# Altium schematic sheet _Mainboard.SchDoc
size A4
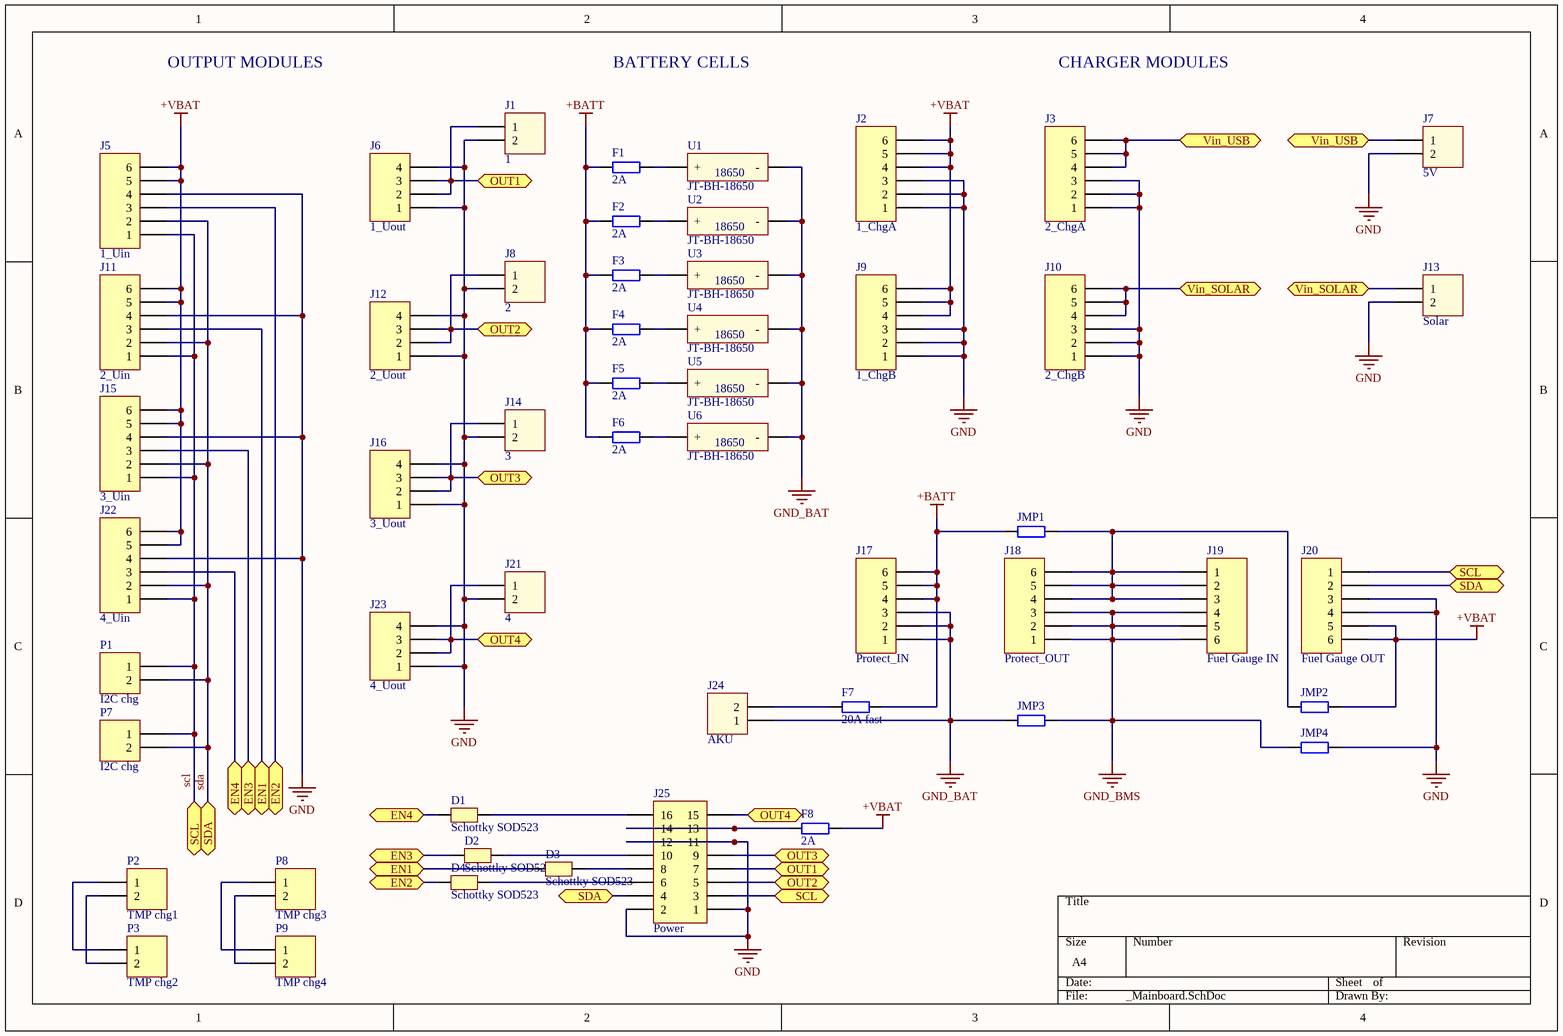
[diagram p0: _Mainboard.SchDoc]

## Parts
D1  Schottky SOD523  [SOD523]
D2  Schottky SOD523  [SOD523]
D3  Schottky SOD523  [SOD523]
D4  Schottky SOD523  [SOD523]
F1  Valve: 2A  [1206 RES]  (hidden comment: SMD fuse)
F2  Valve: 2A  [1206 RES]  (hidden comment: SMD fuse)
F3  Valve: 2A  [1206 RES]  (hidden comment: SMD fuse)
F4  Valve: 2A  [1206 RES]  (hidden comment: SMD fuse)
F5  Valve: 2A  [1206 RES]  (hidden comment: SMD fuse)
F6  Valve: 2A  [1206 RES]  (hidden comment: SMD fuse)
F7  Valve: 20A fast  [1206 RES]  (hidden comment: SMD fuse)
F8  Valve: 2A  [1206 RES]  (hidden comment: SMD Fuse)
J1  1  [691213510002]
J2  1_ChgA  [HDR1X6]
J3  2_ChgA  [HDR1X6]
J5  1_Uin  [HDR1X6]
J6  1_Uout  [HDR1X4]
J7  5V  [691213510002]
J8  2  [691213510002]
J9  1_ChgB  [HDR1X6]
J10  2_ChgB  [HDR1X6]
J11  2_Uin  [HDR1X6]
J12  2_Uout  [HDR1X4]
J13  Solar  [691213510002]
J14  3  [691213510002]
J15  3_Uin  [HDR1X6]
J16  3_Uout  [HDR1X4]
J17  Protect_IN  [HDR1X6]
J18  Protect_OUT  [HDR1X6]
J19  Fuel Gauge IN  [HDR1X6]
J20  Fuel Gauge OUT  [HDR1X6]
J21  4  [691213510002]
J22  4_Uin  [HDR1X6]
J23  4_Uout  [HDR1X4]
J24  AKU  [691213510002]
J25  Power  [61201621621]
JMP1  Resistor generic  [0603 RES]  (value not drawn)
JMP2  Resistor generic  [0603 RES]  (value not drawn)
JMP3  Resistor generic  [0603 RES]  (value not drawn)
JMP4  Resistor generic  [0603 RES]  (value not drawn)
P1  I2C chg  [HDR1X2]
P2  TMP chg1  [HDR1X2]
P3  TMP chg2  [HDR1X2]
P7  I2C chg  [HDR1X2]
P8  TMP chg3  [HDR1X2]
P9  TMP chg4  [HDR1X2]
U1  JT-BH-18650  [18650 holder]
U2  JT-BH-18650  [18650 holder]
U3  JT-BH-18650  [18650 holder]
U4  JT-BH-18650  [18650 holder]
U5  JT-BH-18650  [18650 holder]
U6  JT-BH-18650  [18650 holder]

## Ports
EN1, EN2, EN3, EN4, OUT1, OUT2, OUT3, OUT4, SCL, SDA, Vin_SOLAR, Vin_USB

## Nets
+BATT: F1.1 F2.1 F3.1 F4.1 F5.1 F6.1 F7.2 J17.4 J17.5 J17.6 JMP1.1
+VBAT: F8.2 J2.4 J2.5 J2.6 J5.5 J5.6 J9.4 J9.5 J9.6 J11.5 J11.6 J15.5 J15.6 J20.5 J20.6 J22.5 J22.6 JMP2.2
GND: J1.2 J2.1 J2.2 J2.3 J3.1 J3.2 J3.3 J5.4 J6.1 J6.4 J7.2 J8.2 J9.1 J9.2 J9.3 J10.1 J10.2 J10.3 J11.4 J12.1 J12.4 J13.2 J14.2 J15.4 J16.1 J16.4 J20.3 J20.4 J21.2 J22.4 J23.1 J23.4 J25.1 J25.2 J25.11 J25.12 JMP4.2
GND_BAT: J17.1 J17.2 J17.3 J24.1 JMP3.1 U1.2(-) U2.2(-) U3.2(-) U4.2(-) U5.2(-) U6.2(-)
GND_BMS: J18.1 J18.2 J18.3 J19.4 J19.5 J19.6 JMP3.2 JMP4.1
EN1: D3.2 J11.3 ; port EN1
EN2: D4.2 J5.3 ; port EN2
EN3: D2.2 J15.3 ; port EN3
EN4: D1.2 J22.3 ; port EN4
OUT1: J1.1 J6.2 J6.3 J25.7 ; port OUT1
OUT2: J8.1 J12.2 J12.3 J25.5 ; port OUT2
OUT3: J14.1 J16.2 J16.3 J25.9 ; port OUT3
OUT4: J21.1 J23.2 J23.3 J25.15 ; port OUT4
scl: J5.1 J11.1 J15.1 J20.1 J22.1 J25.3 P1.1 P7.1 ; port SCL
sda: J5.2 J11.2 J15.2 J20.2 J22.2 J25.4 P1.2 P7.2 ; port SDA
Vin_SOLAR: J10.4 J10.5 J10.6 J13.1 ; port Vin_SOLAR
Vin_USB: J3.4 J3.5 J3.6 J7.1 ; port Vin_USB
NetD1_1: D1.1 J25.16
NetD2_1: D2.1 J25.10
NetD3_1: D3.1 J25.8
NetD4_1: D4.1 J25.6
NetF1_2: F1.2 U1.1(+)
NetF2_2: F2.2 U2.1(+)
NetF3_2: F3.2 U3.1(+)
NetF4_2: F4.2 U4.1(+)
NetF5_2: F5.2 U5.1(+)
NetF6_2: F6.2 U6.1(+)
NetF7_1: F7.1 J24.2
NetF8_1: F8.1 J25.13 J25.14
NetJ18_4: J18.4 J18.5 J18.6 J19.1 J19.2 J19.3 JMP1.2 JMP2.1
NetP2_1: P2.1 P3.1
NetP2_2: P2.2 P3.2
NetP8_1: P8.1 P9.1
NetP8_2: P8.2 P9.2

## Notes on the sheet
- OUTPUT MODULES
- BATTERY CELLS
- CHARGER MODULES
- (in symbol 18650 holder) 18650

## Library data of the parts
D1-D4 F1-F6 F8 = Resistor
F7 = Resistor: Farnell  1832127; Code: Littlefuse 1206SFH200F/24-2; Farnell: 1832127
J1 J7 J13 J14 J21 J24 = 691213510002: 2P 5.08 screw terminal; Pitch: 5.08 mm; Pin Number: 2; ComponentLink1Description: Manufacturer; ComponentLink1URL: http://www.we-online.de; ComponentLink2Description: Datasheet; ComponentLink2URL: http://katalog.we-online.de/em/datasheet/6912135100XX.pdf; Part Number: 691213510002; Published Date: March 2017; Publisher: Wurth Elektronik
J2 J3 J5 J9-J11 J15 J17-J20 J22 = Header 6: Header, 6-Pin
J6 J12 J16 J23 = Header 4: Header, 4-Pin; LatestRevisionDate: 17-Jul-2002; LatestRevisionNote: Re-released for DXP Platform.; Publisher: Altium Limited
J8 = 691213510002: 2P 5.08 screw terminal; Pitch: 5.08 mm; ComponentLink1Description: Manufacturer; ComponentLink1URL: http://www.we-online.de; ComponentLink2Description: Datasheet; ComponentLink2URL: http://katalog.we-online.de/em/datasheet/6912135100XX.pdf; Part Number: 691213510002; Published Date: March 2017; Publisher: Wurth Elektronik; Pin Number: 2
J25 = 61201621621: WR-BHD 2.54mm Male Box Header; Manufacturer: Wurth Elektronik; ComponentLink1 Description: Manufacturer; ComponentLink2 Description: Datasheet; NoPins: 16; Created Date: March 2016; partNo: 61201621621; ComponentLink1URL: http://www.we-online.com; ComponentLink2URL: http://katalog.we-online.de/em/datasheet/6120xx21621.pdf; Created by: Baojun Chen
JMP1-JMP4 = Resistor: Resistor SMD; Valve: *
P1-P3 P7-P9 = Header 2: Header, 2-Pin; LatestRevisionDate: 17-Jul-2002; LatestRevisionNote: Re-released for DXP Platform.; Publisher: Altium Limited
U1-U6 = 18650 holder: Producer: http://jiatelcn.com